# EAGLE design purple-eye (EAGLE 7.6.0)
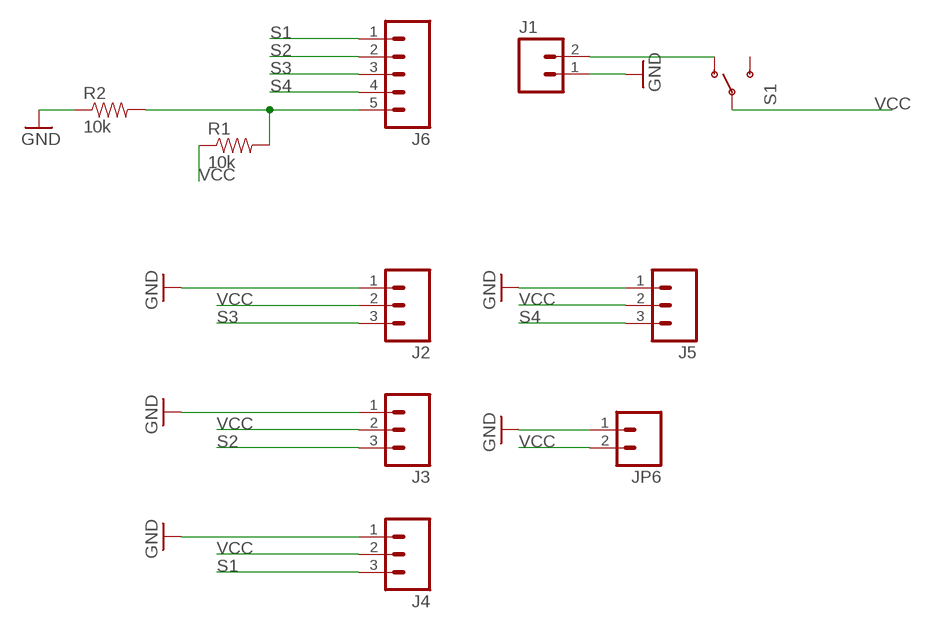
[diagram p0: schematic, sheet 1]

## Parts
J1  M02JST-PTH-2  [JST-2-PTH]
J2  M03LOCK  [1X03_LOCK]
J3  M03LOCK  [1X03_LOCK]
J4  M03LOCK  [1X03_LOCK]
J5  M03LOCK  [1X03_LOCK]
J6  M05LOCK  [1X05_LOCK]
JP6  M02LOCK  [1X02_LOCK]
R1  10k  10KOHM-1/4W5%(PTH)HORIZ-KIT  [AXIAL-0.3EZ]
R2  10k  10KOHM-1/4W5%(PTH)HORIZ-KIT  [AXIAL-0.3EZ]
S1  SWITCH-SPDTPTH_LOCK  [SWITCH-SPDT_LOCK.007S]

## Nets
GND: J1.1 J2.1 J3.1 J4.1 J5.1 JP6.1 R2.P$1
N$1: J6.5 R1.P$2 R2.P$2
N$2: J1.2 S1.1(O)
S1: J4.3 J6.1
S2: J3.3 J6.2
S3: J2.3 J6.3
S4: J5.3 J6.4
VCC: J2.2 J3.2 J4.2 J5.2 JP6.2 R1.P$1 S1.2(P)
Unconnected: S1.3(S)

## Library data of the parts
J1 = SparkFun-Connectors:M02: Standard 2-pin 0.1" header. Use with - straight break away headers ( PRT-00116) - right angle break away headers (PRT-00553) - swiss pins (PRT-00743) - machine pins (PRT-00117) - female headers (PRT-00115) Molex polarized connector foot print use with: PRT-08233 with associated crimp pins and housings. 2.54_SCREWTERM for use with PRT-10571. 3.5mm Screw Terminal footprints for PRT-08084 5mm Screw Terminal footprints for use with PRT-08432; PROD_ID: CONN-09863; SKU: PRT-09914
J2-J5 = SparkFun-Connectors:M03: Header 3 Standard 3-pin 0.1" header. Use with straight break away headers (SKU : PRT-00116), right angle break away headers (PRT-00553), swiss pins (PRT-00743), machine pins (PRT-00117), and female headers (PRT-00115). Molex polarized connector foot print use with SKU : PRT-08232 with associated crimp pins and housings.
J6 = SparkFun-Connectors:M05: Header 5 Standard 5-pin 0.1" header. Use with straight break away headers (SKU : PRT-00116), right angle break away headers (PRT-00553), swiss pins (PRT-00743), machine pins (PRT-00117), and female headers (PRT-00115). Molex polarized connector foot print use with SKU : PRT-08230 with associated crimp pins and housings.
JP6 = SparkFun-Connectors:M02: Standard 2-pin 0.1" header. Use with - straight break away headers ( PRT-00116) - right angle break away headers (PRT-00553) - swiss pins (PRT-00743) - machine pins (PRT-00117) - female headers (PRT-00115) Molex polarized connector foot print use with: PRT-08233 with associated crimp pins and housings. 2.54_SCREWTERM for use with PRT-10571. 3.5mm Screw Terminal footprints for PRT-08084 5mm Screw Terminal footprints for use with PRT-08432
R1 R2 = SparkFun-Resistors:10KOHM-1/4W5%(PTH): RES-09435; PROD_ID: RES-9435
S1 = SparkFun-Electromechanical:SWITCH-SPDT: SPDT Switch Simple slide switch, Spark Fun Electronics SKU : COM-00102 DPDT SMT slide switch, AYZ0202, SWCH-08179

## Board
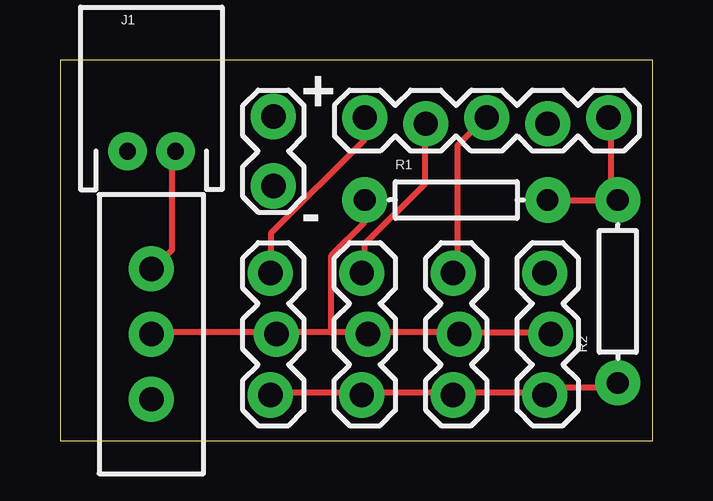
[diagram p1: board, top side]
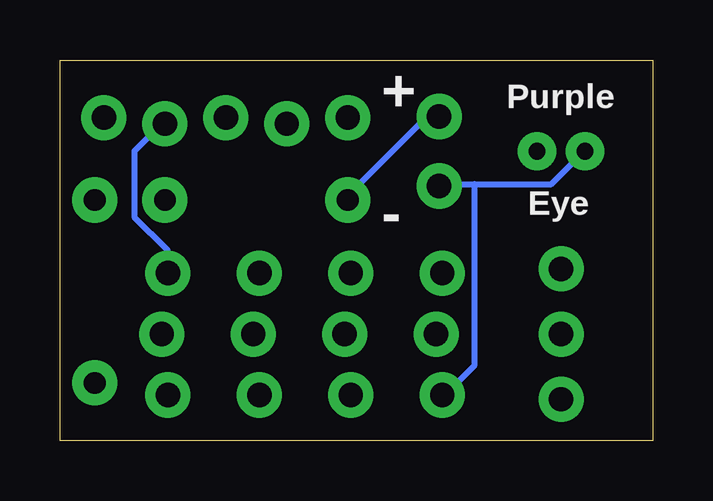
[diagram p2: board, bottom side, seen from below]

Size 24.69 x 15.87 mm. Coordinates in mm from the lower left corner, seen from the top.
Outline: 0,0 24.69,0 24.69,15.87 0,15.87 0,0
Copper layers (1*16): Top 0.035mm / dielectric 1.5mm / Bottom 0.035mm
Design rules "default": minimum track width 10mil, minimum drill 24mil, track to track 8mil, track to pad 8mil, pad to pad 8mil, via to via 8mil, smd to smd 8mil, copper to edge 40mil, drill to drill 8mil, minimum pad ring 10mil, minimum via ring 8mil, stop-mask expansion 4mil, vias tented up to drill 0mil, thermal gap 10mil

### Footprints (pad centres in the part's own frame; a part is rotated, then mirrored left to right if it is on the bottom)
JST-2-PTH = drill 0.7 pad 1.6: 1 -1,0; 2 1,0
1X03_LOCK = drill 1.016 pad 1.88: 1 0,0.127; 2 2.54,-0.127; 3 5.08,0.127
1X05_LOCK = drill 1.016 pad 1.88: 1 0,0.127; 2 2.54,-0.127; 3 5.08,0.127; 4 7.62,-0.127; 5 10.16,0.127
1X02_LOCK = drill 1.016 pad 1.88: 1 -0.178,0; 2 2.718,0
AXIAL-0.3EZ = drill 0.9 pad 1.88: P$1 -3.81,0; P$2 3.81,0
SWITCH-SPDT_LOCK.007S = drill 1.016 pad 1.88: 1 0,2.718; 2 0,0; 3 0,-2.718

### Placement (x,y rotation side)
J1  3.81,12.06 0 top
J2  16.51,1.9 90 top
J3  12.7,1.9 90 top
J4  8.89,1.9 90 top
J5  20.32,1.9 90 top
J6  12.7,13.34 0 top
JP6  8.89,10.8 90 top
R1  16.51,10.03 0 top
R2  23.24,6.22 90 top
S1  3.81,4.45 0 top

### Tracks (layer width: path | path; a pad name or v marks a point on that pad's centre or on a via)
GND
  Top 0.254: J4.1 8.79,2.01 12.45,2.01 J3.1 12.67,2.01 16.33,2.01 J2.1 16.56,2.01 19.99,2.01 J5.1 20.22,2.01 20.45,2.23 23.19,2.23 R2.P$1
  Bottom 0.254: 7.42,10.69 8.79,10.69 JP6.1 | 7.42,10.69 4.22,10.69 2.84,12.06 J1.1 | 7.42,10.69 7.42,3.15 8.56,2.01 J4.1
N$1
  Top 0.254: 22.96,10.01 23.19,10.01 R2.P$2 22.96,10.01 | 22.96,10.01 20.45,10.01 R1.P$2 | 22.96,10.01 22.96,13.44 J6.5
N$2
  Top 0.254: J1.2 4.67,12.06 4.67,7.95 3.99,7.26 S1.1
S1
  Top 0.254: J4.3 8.79,7.04 8.79,8.64 12.67,12.52 12.67,13.44 J6.1
S2
  Top 0.254: J3.3 12.67,7.04 12.67,8.18 15.19,10.69 15.19,13.21 J6.2
S3
  Top 0.254: J2.3 16.56,7.04 16.56,12.29 17.7,13.44 J6.3
S4
  Bottom 0.254: J5.3 20.22,7.04 20.22,7.95 21.59,9.32 21.59,12.06 20.45,13.21 J6.4
VCC
  Top 0.254: 9.02,4.52 3.99,4.52 S1.2 | J5.2 20.45,4.52 16.79,4.52 J2.2 16.56,4.52 12.9,4.52 J3.2 12.67,4.52 11.3,4.52 | 11.3,4.52 9.02,4.52 | 9.02,4.52 J4.2 | 11.3,4.52 11.3,7.72 12.67,9.09 12.67,10.01 R1.P$1
  Bottom 0.254: JP6.2 9.02,13.44 9.47,13.44 12.67,10.24 R1.P$1

### Text on the board
tNames: + | -
bNames: Purple | + | Eye | -